# Altium schematic sheet УШЯИ.411522.033Э3_3.SCHDOC
size 420 x 297 mm; SheetNumber: 3; SheetTotal: 5; DocumentName: Sheet1.SCHDOC
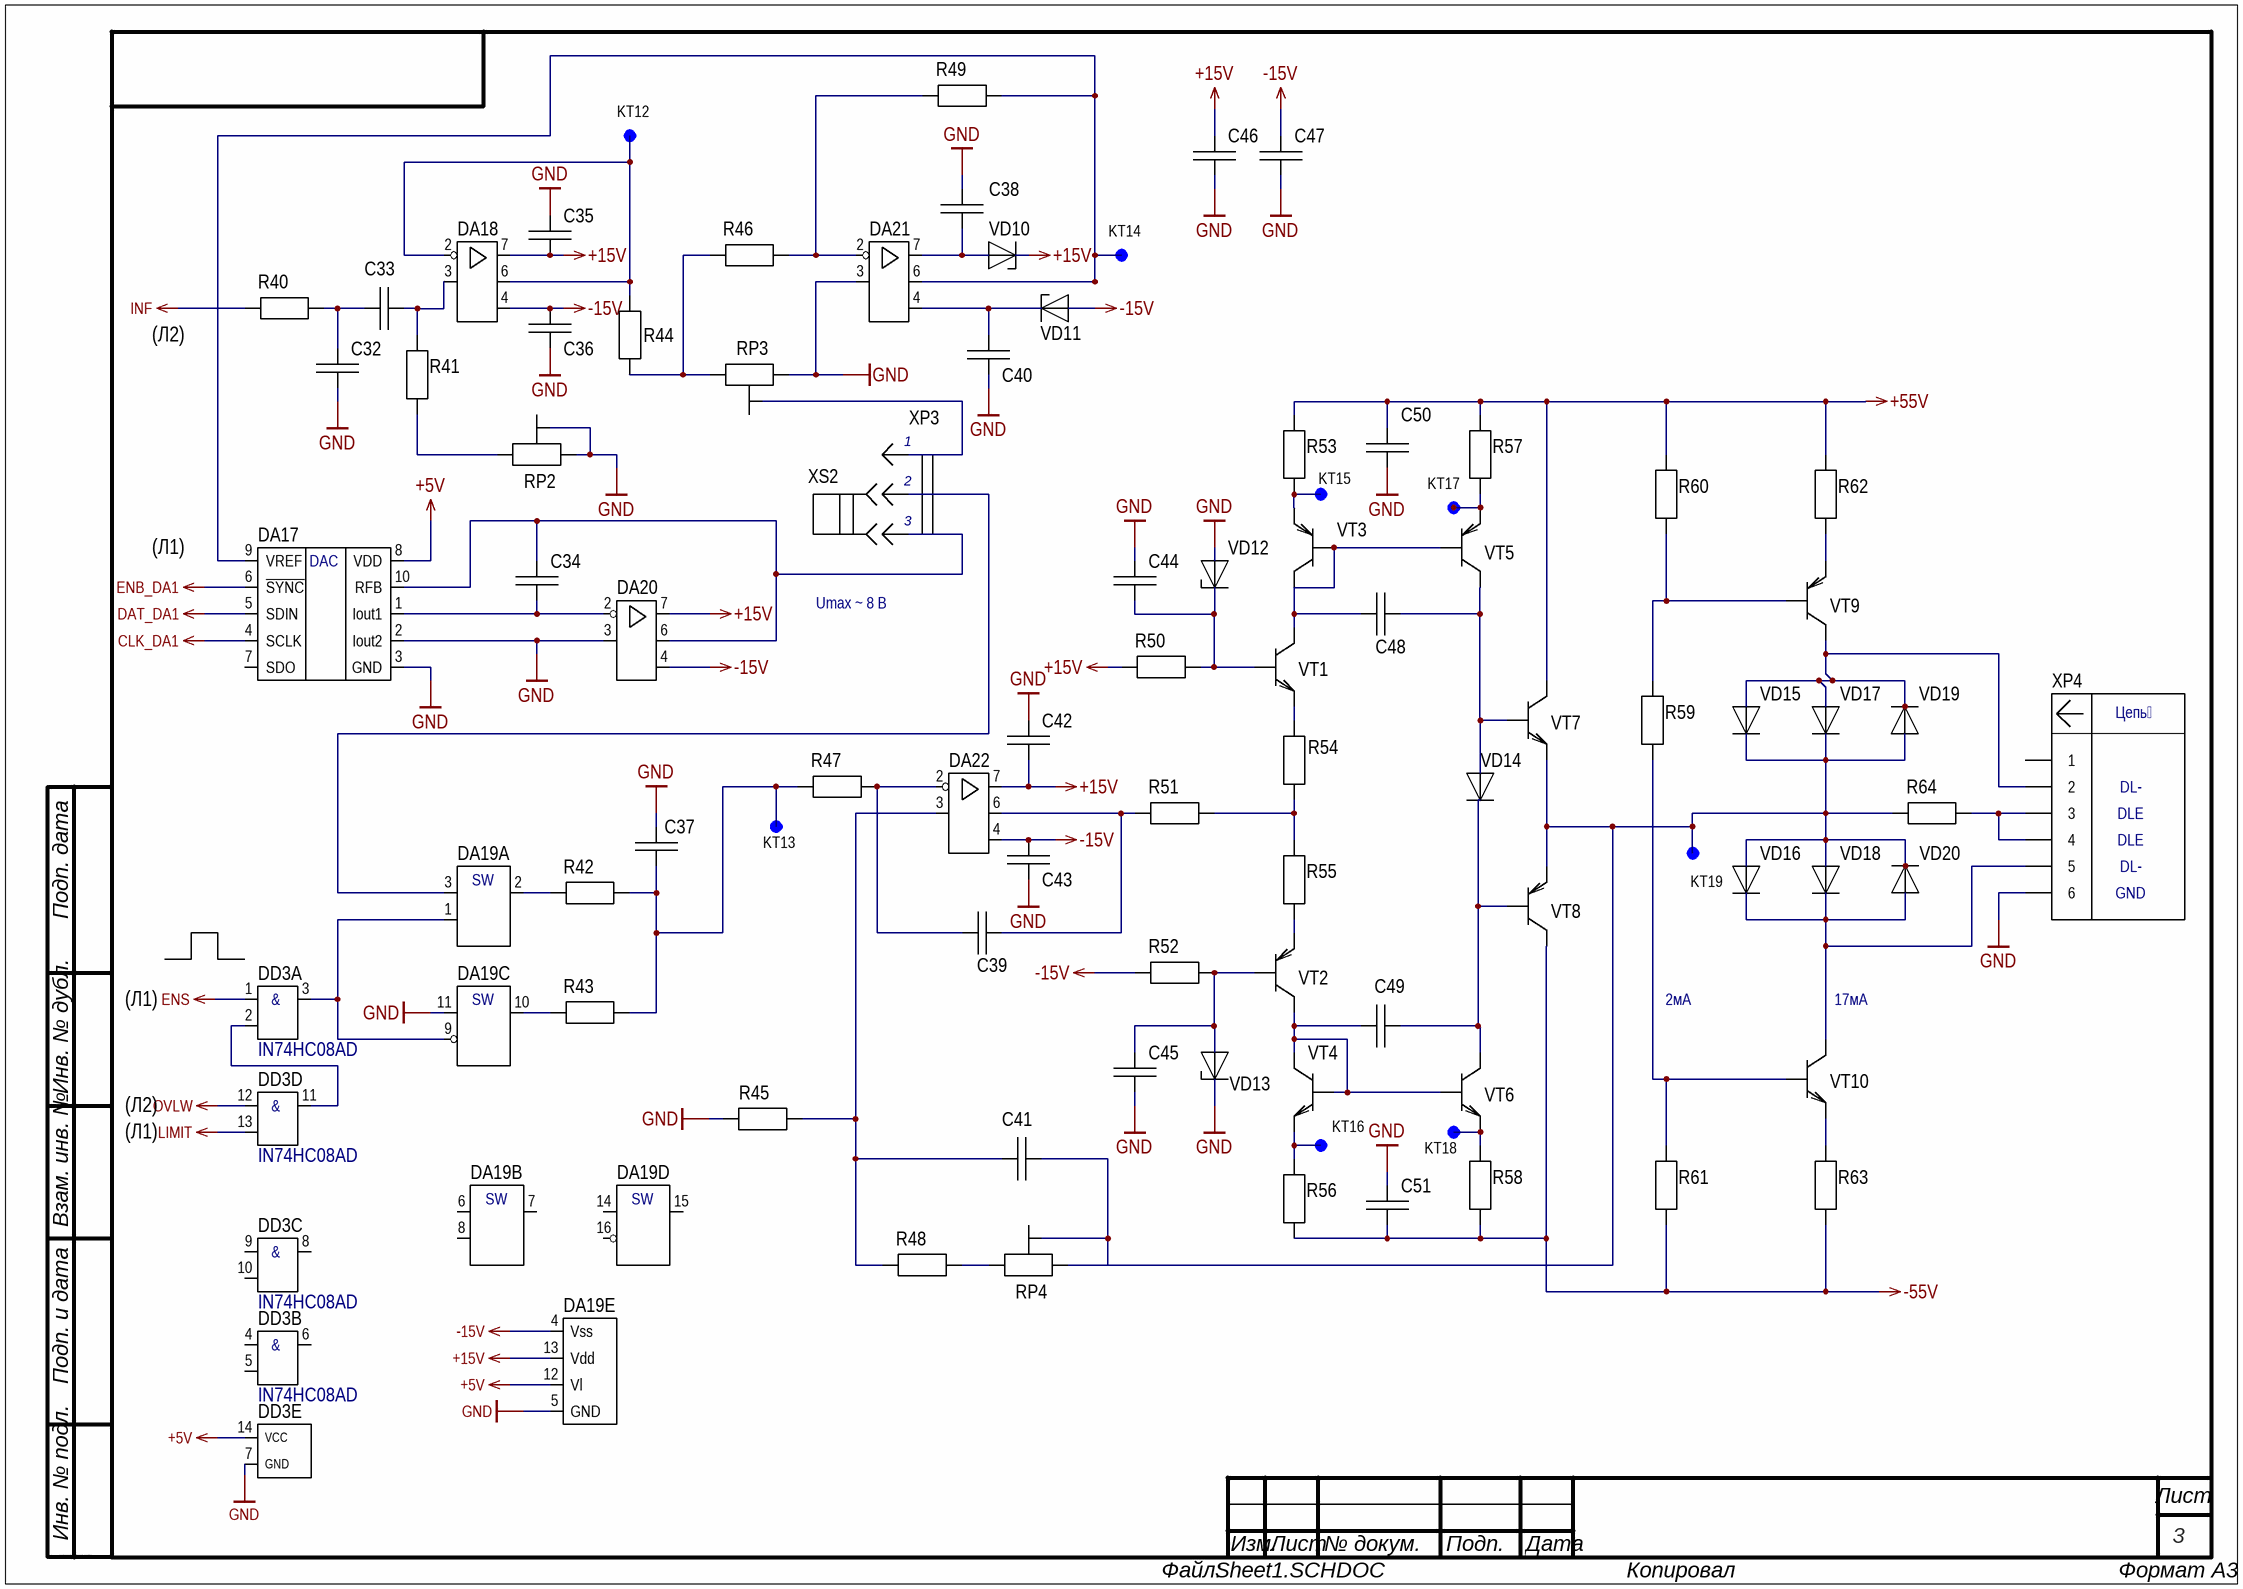
[diagram p0: УШЯИ.411522.033Э3_3.SCHDOC]

## Parts
C32  К73-17-63 В-0,47 мкФ +-5%  [К73-17-A15]  (value not drawn)
C33  К73-17-63 В-0,47 мкФ +-5%  [К73-17-A15]  (value not drawn)
C34  1206-X7R-50 B-33 пФ+-10%  [CAP: 1206]  (value not drawn)
C35  1206-X7R-50 B-0,33 мкФ+-10%  [CAP: 1206]  (value not drawn)
C36  1206-X7R-50 B-0,33 мкФ+-10%  [CAP: 1206]  (value not drawn)
C37  1206-X7R-50 B-39 нФ+-10%  [CAP: 1206]  (value not drawn)
C38  1206-X7R-50 B-0,33 мкФ+-10%  [CAP: 1206]  (value not drawn)
C39  1206-X7R-50 B-100 пФ+-10%  [CAP: 1206]  (value not drawn)
C40  1206-X7R-50 B-0,33 мкФ+-10%  [CAP: 1206]  (value not drawn)
C41  1206-X7R-50 B-100 пФ+-10%  [CAP: 1206]  (value not drawn)
C42  1206-X7R-50 B-0,33 мкФ+-10%  [CAP: 1206]  (value not drawn)
C43  1206-X7R-50 B-0,33 мкФ+-10%  [CAP: 1206]  (value not drawn)
C44  1206-X7R-50 B-0,33 мкФ+-10%  [CAP: 1206]  (value not drawn)
C45  1206-X7R-50 B-0,33 мкФ+-10%  [CAP: 1206]  (value not drawn)
C46  1206-X7R-50 B-0,33 мкФ+-10%  [CAP: 1206]  (value not drawn)
C47  1206-X7R-50 B-0,33 мкФ+-10%  [CAP: 1206]  (value not drawn)
C48  1206-X7R-50 B-150 пФ+-10%  [CAP: 1206]  (value not drawn)
C49  1206-X7R-50 B-150 пФ+-10%  [CAP: 1206]  (value not drawn)
C50  1206-X7R-50 B-68 нФ+-10%  [CAP: 1206]  (value not drawn)
C51  1206-X7R-50 B-68 нФ+-10%  [CAP: 1206]  (value not drawn)
DA17  AD5443YRM  [10-MSOP]  (value not drawn)
DA18  ADA4627-1ARZ  [8-SOIC]  (value not drawn)
DA19  ADG433BR  [16-SOIC]  (value not drawn)  (parts A,B,C,D,E of 5)
DA20  ADA4627-1ARZ  [8-SOIC]  (value not drawn)
DA21  ADA4627-1ARZ  [8-SOIC]  (value not drawn)
DA22  AD8671AR  [8-SOIC]  (value not drawn)
DD3  IN74HC08AD  [14-SOIC]  (parts A,B,C,D,E of 5)
KT12  OTV10  [OTV10]  (value not drawn)  (no BOM)
KT13  OTV10  [OTV10]  (value not drawn)  (no BOM)
KT14  OTV10  [OTV10]  (value not drawn)  (no BOM)
KT15  OTV10  [OTV10]  (value not drawn)  (no BOM)
KT16  OTV10  [OTV10]  (value not drawn)  (no BOM)
KT17  OTV10  [OTV10]  (value not drawn)  (no BOM)
KT18  OTV10  [OTV10]  (value not drawn)  (no BOM)
KT19  OTV10  [OTV10]  (value not drawn)  (no BOM)
R40  1206-9,53 кОм+-1%  [1206]  (value not drawn)
R41  1206-4,32 кОм+-1%  [1206]  (value not drawn)
R42  1206-510 Ом+-5%  [1206]  (value not drawn)
R43  1206-510 Ом+-5%  [1206]  (value not drawn)
R44  1206-910 Ом+-5%  [1206]  (value not drawn)
R45  1206-11 кОм+-5%  [1206]  (value not drawn)
R46  1206-12 кОм+-1%  [1206]  (value not drawn)
R47  1206-12 кОм+-5%  [1206]  (value not drawn)
R48  1206-47 кОм+-5%  [1206]  (value not drawn)
R49  1206-12 кОм+-1%  [1206]  (value not drawn)
R50  1206-6,8 кОм+-5%  [1206]  (value not drawn)
R51  1206-2,4 кОм+-5%  [1206]  (value not drawn)
R52  1206-6,8 кОм+-5%  [1206]  (value not drawn)
R53  1206-1,3 кОм+-5%  [1206]  (value not drawn)
R54  1206-2,4 кОм+-5%  [1206]  (value not drawn)
R55  1206-2,4 кОм+-5%  [1206]  (value not drawn)
R56  1206-1,3 кОм+-5%  [1206]  (value not drawn)
R57  1206-470 Ом+-5%  [1206]  (value not drawn)
R58  1206-470 Ом+-5%  [1206]  (value not drawn)
R59  2512-47 кОм+-5%  [2512]  (value not drawn)
R60  1206-1,5 кОм+-5%  [1206]  (value not drawn)
R61  1206-1,5 кОм+-5%  [1206]  (value not drawn)
R62  1206-150 Ом+-5%  [1206]  (value not drawn)
R63  1206-150 Ом+-5%  [1206]  (value not drawn)
R64  2512-5,1 Ом+-5%  [2512]  (value not drawn)
RP2  3329H-1-472LF  [3329H]  (value not drawn)
RP3  3329H-1-472LF  [3329H]  (value not drawn)
RP4  3329H-1-223LF  [3329H]  (value not drawn)
VD10  BZX55-C5V6  [DO-35]  (value not drawn)
VD11  BZX55-C5V6  [DO-35]  (value not drawn)
VD12  BZX55-C6V2  [DO-35]  (value not drawn)
VD13  BZX55-C6V2  [DO-35]  (value not drawn)
VD14  1N4148WS  [SOD-323F]  (value not drawn)
VD15  1N4148WS  [SOD-323F]  (value not drawn)
VD16  1N4148WS  [SOD-323F]  (value not drawn)
VD17  1N4148WS  [SOD-323F]  (value not drawn)
VD18  1N4148WS  [SOD-323F]  (value not drawn)
VD19  1N4001WS  [SOD-323]  (value not drawn)
VD20  1N4001WS  [SOD-323]  (value not drawn)
VT1  FZT658  [SOT-23-4]  (value not drawn)
VT2  FZT758  [SOT-23-4]  (value not drawn)
VT3  FZT758  [SOT-23-4]  (value not drawn)
VT4  FZT658  [SOT-23-4]  (value not drawn)
VT5  MJE5730  [TO-220(F)]  (value not drawn)
VT6  TIP48  [TO-220(F)]  (value not drawn)
VT7  TIP48  [TO-220(F)]  (value not drawn)
VT8  MJE5730  [TO-220(F)]  (value not drawn)
VT9  MJE5730  [TO-220(F)]  (value not drawn)
VT10  TIP48  [TO-220(F)]  (value not drawn)
XP3  DS1021-1x3  [DS1021-1x3S]  (value not drawn)
XP4  280372-2  [280372-2]  (value not drawn)
XS2  Jumper, 2.54mm  (value not drawn)

## Nets
+5V: DA17.8(VDD) DA19.12(Vl) DD3.14(VCC)
+15V: C35.1 C42.1 C46.2 DA18.7(V+) DA19.13(Vdd) DA20.7(V+) DA22.7(V+) R50.1 VD10.1
+55V: C50.2 R53.1 R57.2 R60.2 R62.2 VT7.2(Collector)
-15V: C36.2 C43.1 C47.2 DA18.4(V-) DA19.4(Vss) DA20.4(V-) DA22.4(V-) R52.1 VD11.2
-55V: C51.1 R56.1 R58.1 R61.1 R63.1 VT8.2(Collector)
CLK_DA1: DA17.4(SCLK)
DAT_DA1: DA17.5(SDIN)
ENB_DA1: DA17.6(~{SYNC})
ENS: DD3.1(A1)
GND: C32.1 C35.2 C36.1 C37.2 C38.1 C40.1 C42.2 C43.2 C44.2 C45.1 C46.1 C47.1 C50.1 C51.2 DA17.2(Iout2) DA17.3(GND) DA19.5(GND) DA19.11(S3) DA20.3(+IN) DA21.3(+IN) DD3.7(GND) R45.1 RP2.2(WIPER) RP2.3(CW) RP3.3(CW) VD12.2 VD13.1 XP4.6
INF: R40.1
LIMIT: DD3.13(B4)
OVLW: DD3.12(A4)
NetC32_2: C32.2 C33.2 R40.2
NetC33_1: C33.1 DA18.3(+IN) R41.2
NetC34_1: C34.1 DA17.1(Iout1) DA20.2(-IN)
NetC34_2: C34.2 DA17.10(RFB) DA20.6(OUT) XP3.3
NetC37_1: C37.1 KT13.1 R42.2 R43.2 R47.1
NetC38_2: C38.2 DA21.7(V+) VD10.2
NetC39_1: C39.1 DA22.2(-IN) R47.2
NetC39_2: C39.2 DA22.6(OUT) R51.1
NetC40_2: C40.2 DA21.4(V-) VD11.1
NetC41_1: C41.1 DA22.3(+IN) R45.2 R48.1
NetC41_2: C41.2 KT19.1 R64.1 RP4.2(WIPER) RP4.3(CW) VD15.1 VD16.2 VD17.1 VD18.2 VD19.2 VD20.1 VT7.3(Emmiter) VT8.3(Emmiter)
NetC44_1: C44.1 R50.2 VD12.1 VT1.1(B)
NetC45_2: C45.2 R52.2 VD13.2 VT2.1(B)
NetC48_1: C48.1 VT1.2(C) VT3.1(B) VT3.2(C) VT5.1(Base)
NetC48_2: C48.2 VD14.2 VT5.2(Collector) VT7.1(Base)
NetC49_1: C49.1 VT2.2(C) VT4.1(B) VT4.2(C) VT6.1(Base)
NetC49_2: C49.2 VD14.1 VT6.2(Collector) VT8.1(Base)
NetDA17_9: DA17.9(VREF) DA21.6(OUT) KT14.1 R49.1
NetDA18_2: DA18.2(-IN) DA18.6(OUT) KT12.1 R44.2
NetDA19_1: DA19.1(IN1) DA19.9(IN3) DD3.3(Y1)
NetDA19_2: DA19.2(D1) R42.1
NetDA19_3: DA19.3(S1) XP3.2
NetDA19_10: DA19.10(D3) R43.1
NetDA21_2: DA21.2(-IN) R46.1 R49.2
NetDD3_2: DD3.2(B1) DD3.11(Y4)
NetKT15_1: KT15.1 R53.2 VT3.3(E)
NetKT16_1: KT16.1 R56.2 VT4.3(E)
NetKT17_1: KT17.1 R57.1 VT5.3(Emmiter)
NetKT18_1: KT18.1 R58.2 VT6.3(Emmiter)
NetR41_1: R41.1 RP2.1(CCW)
NetR44_1: R44.1 R46.2 RP3.1(CCW)
NetR48_2: R48.2 RP4.1(CCW)
NetR51_2: R51.2 R54.1 R55.2
NetR54_2: R54.2 VT1.3(E)
NetR55_1: R55.1 VT2.3(E)
NetR59_1: R59.1 R61.2 VT10.1(Base)
NetR59_2: R59.2 R60.1 VT9.1(Base)
NetR62_1: R62.1 VT9.3(Emmiter)
NetR63_2: R63.2 VT10.3(Emmiter)
NetR64_2: R64.2 XP4.3 XP4.4
NetRP3_2: RP3.2(WIPER) XP3.1
NetVD15_2: VD15.2 VD17.2 VD19.1 VT9.2(Collector) XP4.2
NetVD16_1: VD16.1 VD18.1 VD20.2 VT10.2(Collector) XP4.5

Not connected (* = marked no-connect by the designer): DA17 7(SDO); DA19 6(S4) 7(D4) 8(IN4) 14(S2) 15(D2) 16(IN2); DD3 4(A2) 5(B2) 6(Y2) 8(Y3) 9(A3) 10(B3); XP4 1

## Notes on the sheet
- (Л2)
- (near XP3) 1
- (near XP3) 2
- (near XP3) 3
- (Л1)
- Umax ~ 8 В
- DL-
- DLE
- GND
- 2мА
- (near VT10) 17мА
- Подп. дата
- Инв. № дубл.
- Взам. инв. №
- Подп. и дата
- Инв. № подл.
- Изм.
- Лист
- № докум.
- Подп.
- Дата
- ALTIUM GOSTBOM2.0 KEV
- Файл:
- Копировал
- Формат А3
- (in symbol 280372-2) Цепь
- (in symbol AD5443YRM) DAC
- (in symbol ADG433BR, part A) SW
- (in symbol ADG433BR, part B) SW
- (in symbol ADG433BR, part C) SW
- (in symbol ADG433BR, part D) SW
- (in symbol IN74HC08AD, part A) &
- (in symbol IN74HC08AD, part B) &
- (in symbol IN74HC08AD, part C) &
- (in symbol IN74HC08AD, part D) &

## Library data of the parts
C34 = 1206-X7R-50 B-33 пФ+-10%: Value: 33 пФ
C37 = 1206-X7R-50 B-39 нФ+-10%: Value: 39 нФ
C39 C41 = 1206-X7R-50 B-100 пФ+-10%: Value: 100 пФ
C48 C49 = 1206-X7R-50 B-150 пФ+-10%: Value: 150 пФ
C50 C51 = 1206-X7R-50 B-68 нФ+-10%: Value: 68 нФ
DA17 = AD5443YRM: 12-Bit High Bandwidth / Multiplying DACs with Serial Interface / 10-MSOP
DA18 DA20-DA22 = AD8671AR: Bias Current Operational Amplifiers, Precision, Very Low Noise, Low Input
DA19 = ADG433BR: LC2MOS Precision Quad SPST Switches; Value: *
DD3 = IN74HC08AD: Quad 2-Input AND Gate High-Performance Silicon-Gate CMOS
R42 R43 = 1206-510 Ом+-5%: Value: 510 Ом; ModelPrint: 1206
R44 = 1206-910 Ом+-5%: Value: 910 Ом; ModelPrint: 1206
R45 = 1206-11 кОм+-5%: Value: 11 кОм; ModelPrint: 1206
R46 R49 = 1206-12 кОм+-1%: Value: 12 кОм; ModelPrint: 1206
R47 = 1206-12 кОм+-5%: Value: 12 кОм; ModelPrint: 1206
R48 = 1206-47 кОм+-5%: Value: 47 кОм; ModelPrint: 1206
R50 R52 = 1206-6,8 кОм+-5%: Value: 6,8 кОм; ModelPrint: 1206
R51 R54 R55 = 1206-2,4 кОм+-5%: Value: 2,4 кОм; ModelPrint: 1206
R53 R56 = 1206-1,3 кОм+-5%: Value: 1,3 кОм; ModelPrint: 1206
R57 R58 = 1206-470 Ом+-5%: Value: 470 Ом; ModelPrint: 1206
R59 = 2512-47 кОм+-5%: Value: 47 кОм; ModelPrint: 2512
R60 R61 = 1206-1,5 кОм+-5%: Value: 1,5 кОм; ModelPrint: 1206
R62 R63 = 1206-150 Ом+-5%: Value: 150 Ом; ModelPrint: 1206
R64 = 2512-5,1 Ом+-5%: Value: 5,1 Ом; ModelPrint: 2512
RP2 RP3 = 3329H-1-472LF: Variable Resistor 4.7kOm
RP4 = 3329H-1-223LF: Variable Resistor 22kOm
VD10 VD11 = BZX55-C5V6: Стабилитрон BZX55-C5V6; Value: *
VD12 VD13 = BZX55-C6V2: Стабилитрон BZX55-C6V2; Value: *
VD14-VD18 = 1N4148WS: Small Signal Fast Switching Diod; Value: *
VD19 VD20 = 1N4001WS: General Purpose Plastic Rectifier; Value: *
VT1 VT4 = FZT658: pin to pad: 2>2+4
VT2 VT3 = FZT758: pin to pad: 2>2+4
VT5 VT8 VT9 = MJE5730: N-Channel 300V 1A 50W
VT6 VT7 VT10 = TIP48: NPN SWITCHING TRANSISTOR
XP4 = 280372-2: Connector
C32 C33 = К73-17-63 В-0,47 мкФ +-5%: Value: *
C35 C36 C38 C40 C42-C47 = 1206-X7R-50 B-0,33 мкФ+-10%: Value: 0,33 мкФ
R40 = 1206-9,53 кОм+-1%: ModelPrint: 1206; Value: 9,53 кОм
R41 = 1206-4,32 кОм+-1%: ModelPrint: 1206; Value: 4,32 кОм
XP3 = DS1021-1x3: 1: *; 2: *; 3: *